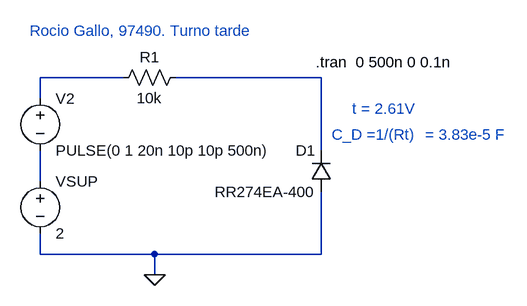
[diagram p0: schematic ejercicio-dispo-actividad-3 2.asc]
ejercicio-dispo-actividad-3 2.asc, the LTspice schematic file:
Version 4
SHEET 1 980 680
WIRE 384 128 256 128
WIRE 688 128 464 128
WIRE 256 160 256 128
WIRE 688 240 688 128
WIRE 256 288 256 240
WIRE 256 400 256 368
WIRE 432 400 256 400
WIRE 688 400 688 304
WIRE 688 400 432 400
WIRE 432 432 432 400
FLAG 432 432 0
SYMBOL diode 704 304 R180
WINDOW 0 24 64 Left 2
WINDOW 3 24 0 Left 2
SYMATTR InstName D1
SYMATTR Value RR274EA-400
SYMBOL voltage 256 272 R0
SYMATTR InstName VSUP
SYMATTR Value 2
SYMBOL voltage 256 144 R0
SYMATTR InstName V2
SYMATTR Value PULSE(0 1 20n 10p 10p 500n)
SYMBOL res 480 112 R90
WINDOW 0 0 56 VBottom 2
WINDOW 3 32 56 VTop 2
SYMATTR InstName R1
SYMATTR Value 10k
TEXT 680 104 Left 2 !.tran  0 500n 0 0.1n
TEXT 240 56 Left 2 ;Rocio Gallo, 97490. Turno tarde
TEXT 736 176 Left 2 ;t = 2.61V
TEXT 704 216 Left 2 ;C_D =1/(Rt)
TEXT 848 216 Left 2 ;= 3.83e-5 F

The netlist it stands for:
* ejercicio-dispo-actividad-3 2.asc
D1 0 N002 RR274EA-400
VSUP N003 0 2
V2 N001 N003 PULSE(0 1 20n 10p 10p 500n)
R1 N002 N001 10k
.model D D
.lib standard.dio
.tran  0 500n 0 0.1n
* Rocio Gallo, 97490. Turno tarde
* t = 2.61V
* C_D =1/(Rt)
* = 3.83e-5 F
.backanno
.end